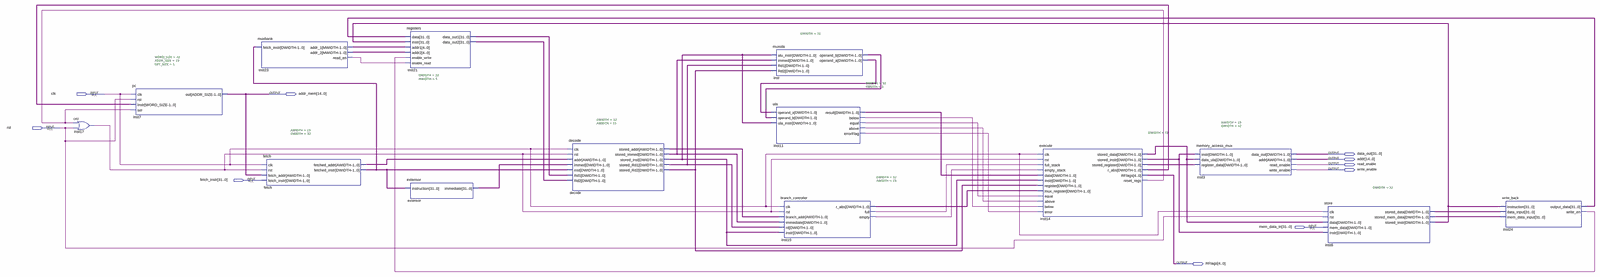
[diagram p0: schematic sheet, whole]
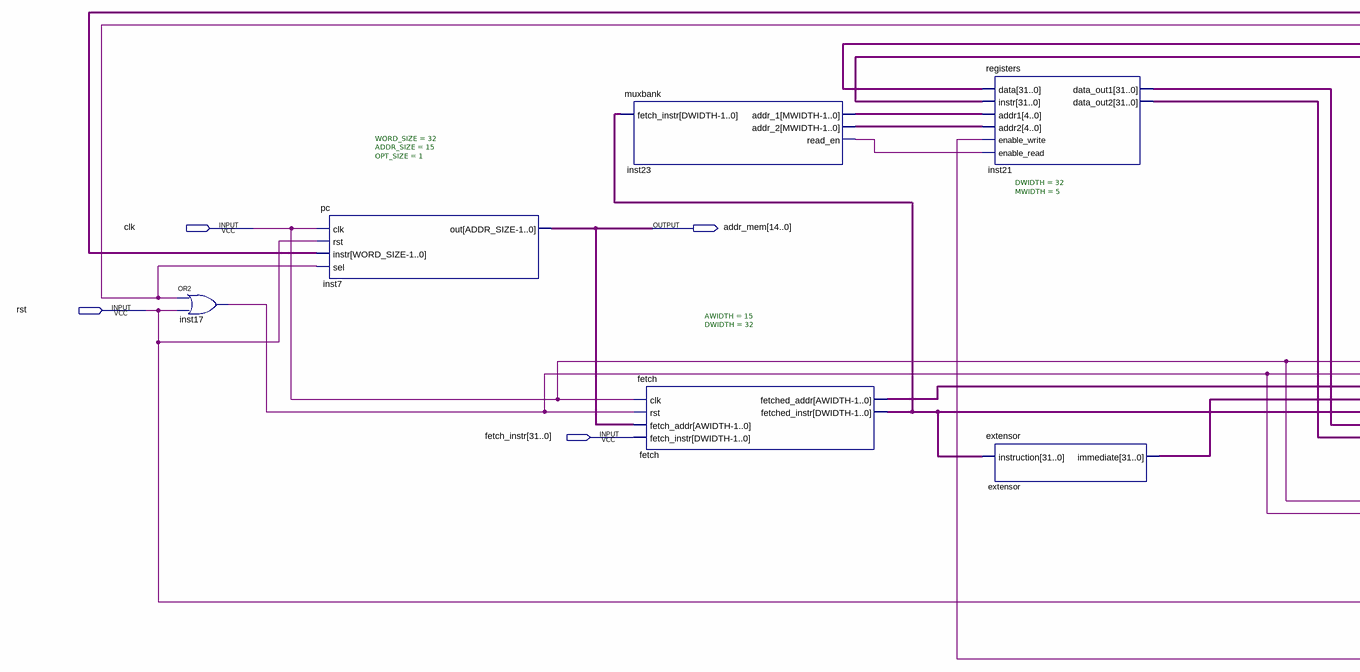
[diagram p1: schematic sheet, left part]
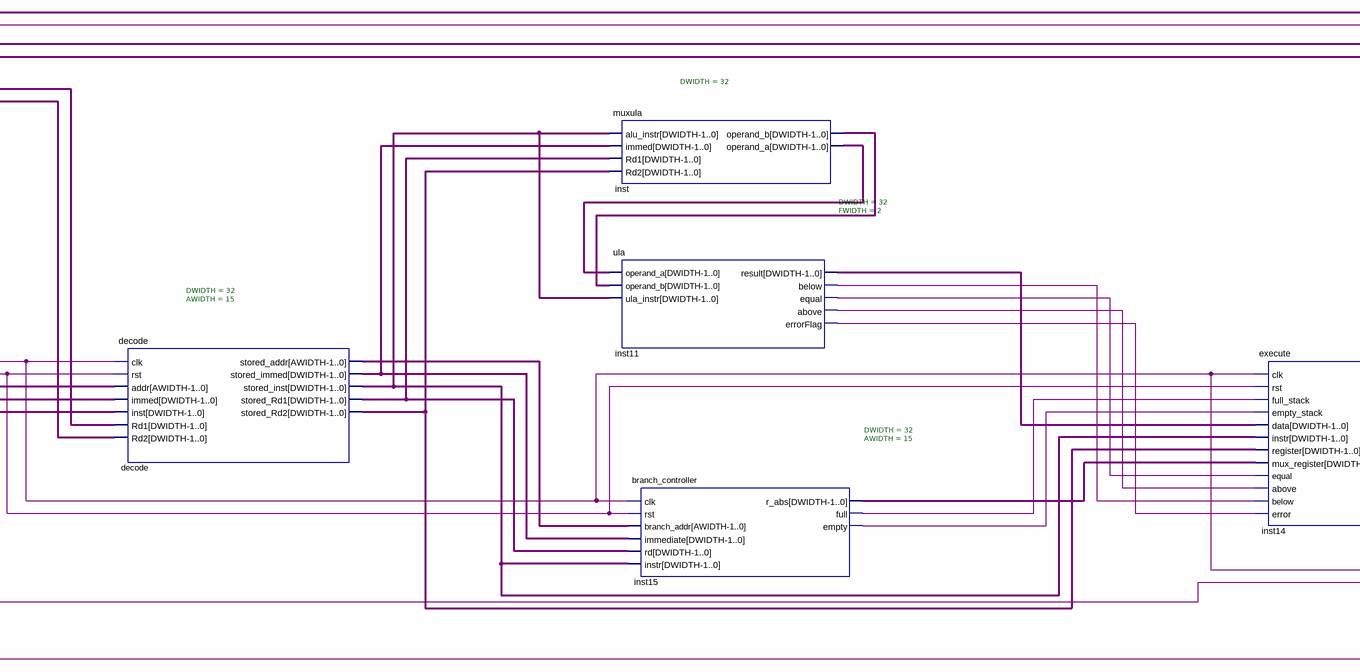
[diagram p2: schematic sheet, centre part]
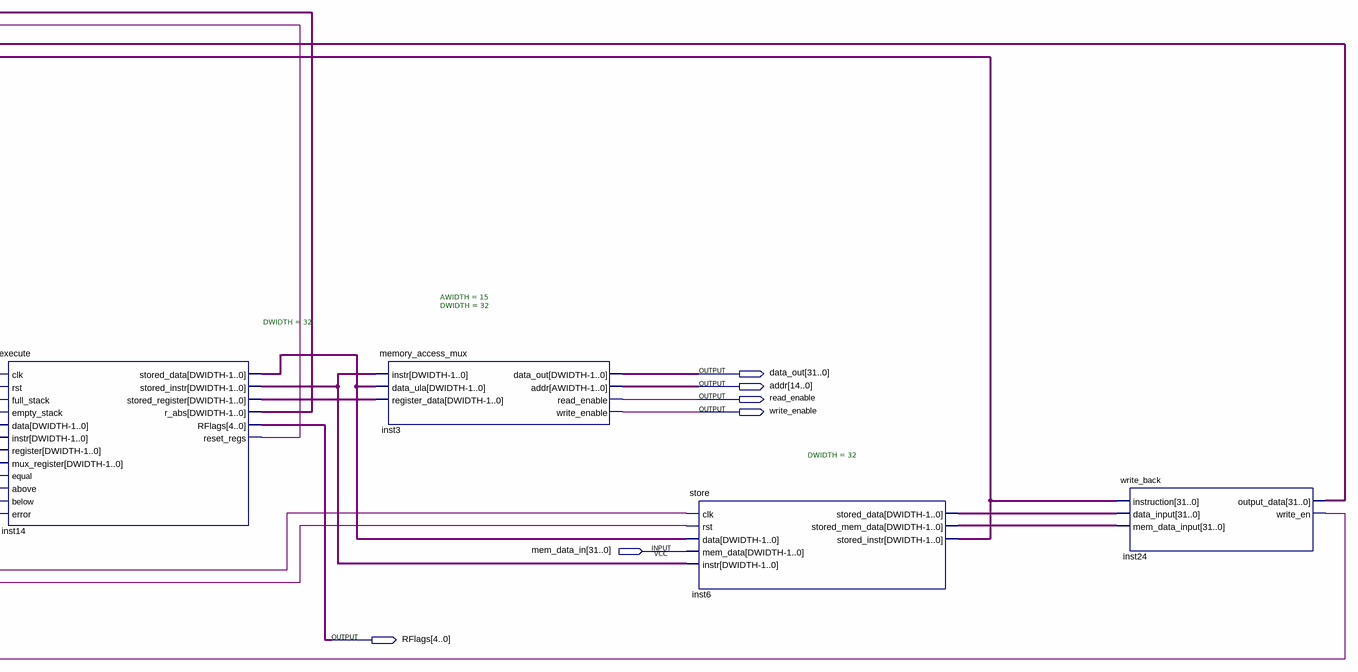
[diagram p3: schematic sheet, right part]
// Quartus schematic cpu.bdf as structural Verilog: 14 symbols, 10 pins
module cpu (
  input  clk,
  input  rst,
  input  [31:0] fetch_instr,
  input  [31:0] mem_data_in,
  output [14:0] addr_mem,
  output [31:0] data_out,
  output [14:0] addr,
  output read_enable,
  output write_enable,
  output [4:0] RFlags
);

  wire inst11_above, inst11_below, inst11_equal, inst11_errorflag, inst14_reset_regs, inst15_empty,
       inst15_full, inst17_out, inst23_read_en, inst24_write_en;
  wire [4:0] inst23_addr_1, inst23_addr_2;
  wire [14:0] decode_stored_addr, fetch_fetched_addr;
  wire [31:0] decode_stored_immed, decode_stored_inst, decode_stored_rd1, decode_stored_rd2,
       extensor_immediate, fetch_fetched_instr, inst6_stored_data, inst6_stored_instr, inst6_stored_mem_data,
       inst11_result, inst14_r_abs, inst14_stored_data, inst14_stored_instr, inst14_stored_register,
       inst15_r_abs, inst21_data_out1, inst21_data_out2, inst24_output_data, inst_operand_a, inst_operand_b;

  or inst17 (inst17_out, inst14_reset_regs, rst);
  pc #(.WORD_SIZE(32), .ADDR_SIZE(15), .OPT_SIZE(1)) inst7 (
    .clk(clk), .rst(rst), .instr(inst14_r_abs), .sel(inst14_reset_regs), .out(addr_mem));
  muxbank #(.DWIDTH(32), .MWIDTH(5)) inst23 (
    .fetch_instr(fetch_fetched_instr), .addr_1(inst23_addr_1), .addr_2(inst23_addr_2),
    .read_en(inst23_read_en));
  fetch #(.AWIDTH(15), .DWIDTH(32)) fetch (
    .clk(clk), .rst(inst17_out), .fetch_addr(addr_mem), .fetch_instr(fetch_instr),
    .fetched_addr(fetch_fetched_addr), .fetched_instr(fetch_fetched_instr));
  registers inst21 (
    .data(inst24_output_data), .instr(inst6_stored_instr), .addr1(inst23_addr_1), .addr2(inst23_addr_2),
    .enable_write(inst24_write_en), .enable_read(inst23_read_en), .data_out1(inst21_data_out1),
    .data_out2(inst21_data_out2));
  extensor extensor (.instruction(fetch_fetched_instr), .immediate(extensor_immediate));
  decode #(.DWIDTH(32), .AWIDTH(15)) decode (
    .clk(clk), .rst(inst17_out), .addr(fetch_fetched_addr), .immed(extensor_immediate),
    .inst(fetch_fetched_instr), .Rd1(inst21_data_out1), .Rd2(inst21_data_out2),
    .stored_addr(decode_stored_addr), .stored_immed(decode_stored_immed), .stored_inst(decode_stored_inst),
    .stored_Rd1(decode_stored_rd1), .stored_Rd2(decode_stored_rd2));
  muxula #(.DWIDTH(32)) inst (
    .alu_instr(decode_stored_inst), .immed(decode_stored_immed), .Rd1(decode_stored_rd1),
    .Rd2(decode_stored_rd2), .operand_b(inst_operand_b), .operand_a(inst_operand_a));
  ula #(.DWIDTH(32), .FWIDTH(2)) inst11 (
    .operand_a(inst_operand_a), .operand_b(inst_operand_b), .ula_instr(decode_stored_inst),
    .result(inst11_result), .below(inst11_below), .equal(inst11_equal), .above(inst11_above),
    .errorFlag(inst11_errorflag));
  branch_controller #(.DWIDTH(32), .AWIDTH(15)) inst15 (
    .clk(clk), .rst(inst17_out), .branch_addr(decode_stored_addr), .immediate(decode_stored_immed),
    .rd(decode_stored_rd1), .instr(decode_stored_inst), .r_abs(inst15_r_abs), .full(inst15_full),
    .empty(inst15_empty));
  execute #(.DWIDTH(32)) inst14 (
    .clk(clk), .rst(inst17_out), .full_stack(inst15_full), .empty_stack(inst15_empty), .data(inst11_result),
    .instr(decode_stored_inst), .register(decode_stored_rd2), .mux_register(inst15_r_abs),
    .equal(inst11_equal), .above(inst11_above), .below(inst11_below), .error(inst11_errorflag),
    .stored_data(inst14_stored_data), .stored_instr(inst14_stored_instr),
    .stored_register(inst14_stored_register), .r_abs(inst14_r_abs), .RFlags(RFlags),
    .reset_regs(inst14_reset_regs));
  memory_access_mux #(.AWIDTH(15), .DWIDTH(32)) inst3 (
    .instr(inst14_stored_instr), .data_ula(inst14_stored_data), .register_data(inst14_stored_register),
    .data_out(data_out), .addr(addr), .read_enable(read_enable), .write_enable(write_enable));
  store #(.DWIDTH(32)) inst6 (
    .clk(clk), .rst(rst), .data(inst14_stored_data), .mem_data(mem_data_in), .instr(inst14_stored_instr),
    .stored_data(inst6_stored_data), .stored_mem_data(inst6_stored_mem_data),
    .stored_instr(inst6_stored_instr));
  write_back inst24 (
    .instruction(inst6_stored_instr), .data_input(inst6_stored_data), .mem_data_input(inst6_stored_mem_data),
    .output_data(inst24_output_data), .write_en(inst24_write_en));
endmodule
